# EAGLE schematic MoreE u-blox E-PEAS (EAGLE 9.4.2)

## Sheet 1 of 2
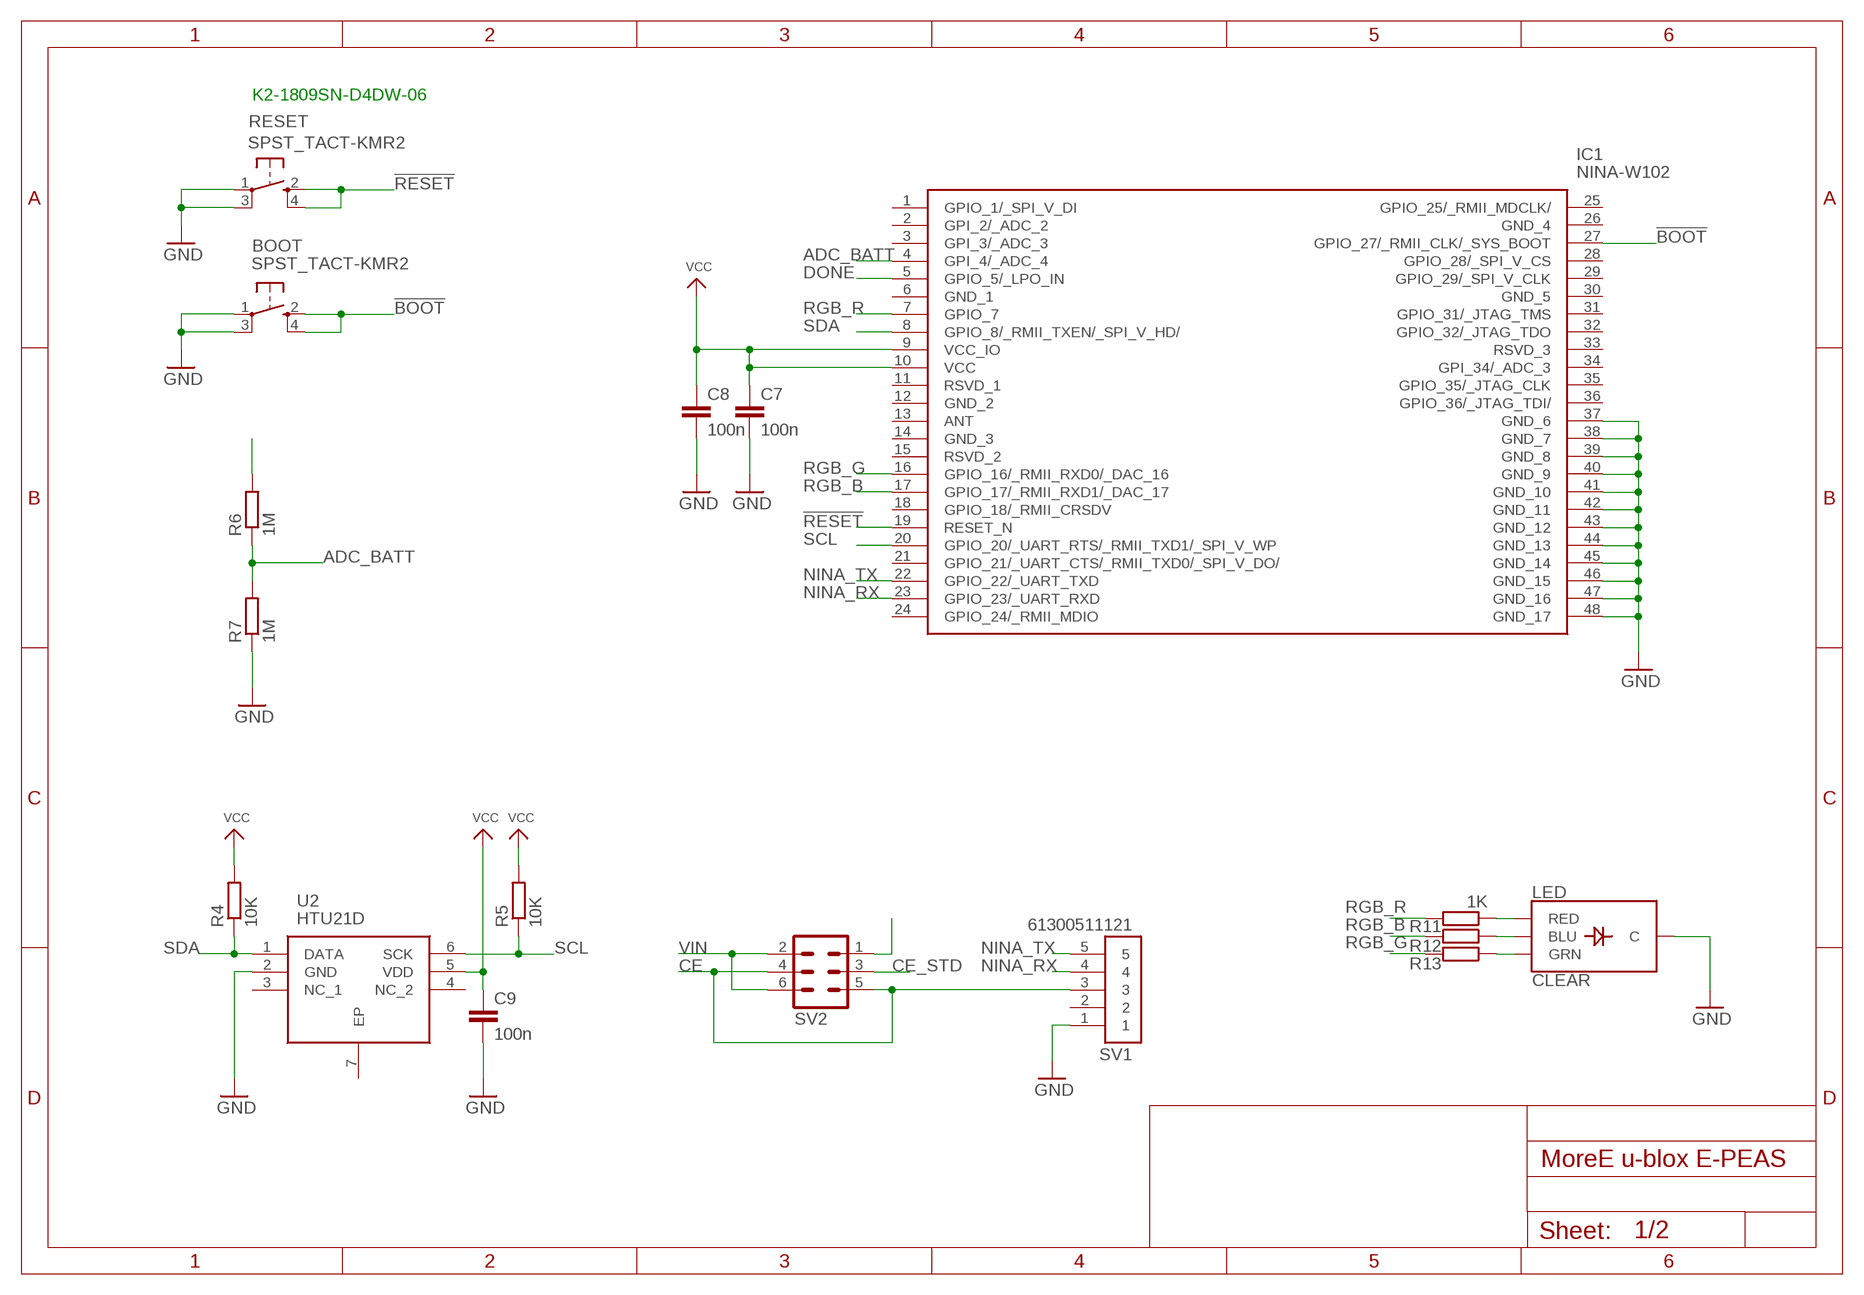
[diagram p0: schematic, sheet 1]

### Parts
BOOT  SPST_TACT-KMR2  [KMR2]
C7  100n  C-EUC0805  [C0805]
C8  100n  C-EUC0805  [C0805]
C9  100n  C-EUC0805  [C0805]
IC1  NINA-W102  [NINAW102]
LED  CLEAR  LED-RGB-CCCLEAR  [LED-RGB-THRU]
R4  10K  R-EU_R0805  [R0805]
R5  10K  R-EU_R0805  [R0805]
R6  1M  R-EU_R0805  [R0805]
R7  1M  R-EU_R0805  [R0805]
R11  1K  R-EU_R0805  [R0805]
R12  1K  R-EU_R0805  [R0805]
R13  1K  R-EU_R0805  [R0805]
RESET  SPST_TACT-KMR2  [KMR2]
SV1  61300511121  [61300511121]
SV2  MA03-2  [MA03-2]
U2  HTU21D  [SON100P300X300X100-7N]

### Nets
!BOOT: BOOT.2(S) BOOT.4(S1) IC1.27(GPIO_27/_RMII_CLK/_SYS_BOOT)
!RESET: IC1.19(RESET_N) RESET.2(S) RESET.4(S1)
ADC_BATT: IC1.4(GPI_4/_ADC_4) R6.1 R7.2
CE: SV1.3 SV2.4 SV2.5 ; also sheet 2
CE_STD: SV2.3 ; also sheet 2
DONE: IC1.5(GPIO_5/_LPO_IN) ; also sheet 2
GND: BOOT.1(P) BOOT.3(P1) C7.2 C8.2 C9.2 IC1.37(GND_6) IC1.38(GND_7) IC1.39(GND_8) IC1.40(GND_9) IC1.41(GND_10) IC1.42(GND_11) IC1.43(GND_12) IC1.44(GND_13) IC1.45(GND_14) IC1.46(GND_15) IC1.47(GND_16) IC1.48(GND_17) LED.2(C) R7.1 RESET.1(P) RESET.3(P1) SV1.1 U2.2(GND) ; also sheet 2
N$9: SV2.1
N$10: R6.2
N$13: LED.1(RED) R11.1
N$14: LED.4(BLU) R12.1
N$15: LED.3(GRN) R13.1
NINA_RX: IC1.23(GPIO_23/_UART_RXD) SV1.4
NINA_TX: IC1.22(GPIO_22/_UART_TXD) SV1.5
RGB_B: IC1.17(GPIO_17/_RMII_RXD1/_DAC_17) R12.2
RGB_G: IC1.16(GPIO_16/_RMII_RXD0/_DAC_16) R13.2
RGB_R: IC1.7(GPIO_7) R11.2
SCL: IC1.20(GPIO_20/_UART_RTS/_RMII_TXD1/_SPI_V_WP) R5.1 U2.6(SCK)
SDA: IC1.8(GPIO_8/_RMII_TXEN/_SPI_V_HD/) R4.1 U2.1(DATA)
VCC: C7.1 C8.1 C9.1 IC1.9(VCC_IO) IC1.10(VCC) R4.2 R5.2 U2.5(VDD) ; also sheet 2
VIN: SV2.2 SV2.6 ; also sheet 2
Unconnected: IC1.1(GPIO_1/_SPI_V_DI) IC1.2(GPI_2/_ADC_2) IC1.3(GPI_3/_ADC_3) IC1.6(GND_1) IC1.11(RSVD_1) IC1.12(GND_2) IC1.13(ANT) IC1.14(GND_3) IC1.15(RSVD_2) IC1.18(GPIO_18/_RMII_CRSDV) IC1.21(GPIO_21/_UART_CTS/_RMII_TXD0/_SPI_V_DO/) IC1.24(GPIO_24/_RMII_MDIO) IC1.25(GPIO_25/_RMII_MDCLK/) IC1.26(GND_4) IC1.28(GPIO_28/_SPI_V_CS) IC1.29(GPIO_29/_SPI_V_CLK) IC1.30(GND_5) IC1.31(GPIO_31/_JTAG_TMS) IC1.32(GPIO_32/_JTAG_TDO) IC1.33(RSVD_3) IC1.34(GPI_34/_ADC_3) IC1.35(GPIO_35/_JTAG_CLK) IC1.36(GPIO_36/_JTAG_TDI/) SV1.2 U2.3(NC_1) U2.4(NC_2) U2.7(EP)

### Notes on the sheet
- K2-1809SN-D4DW-06

## Sheet 2 of 2
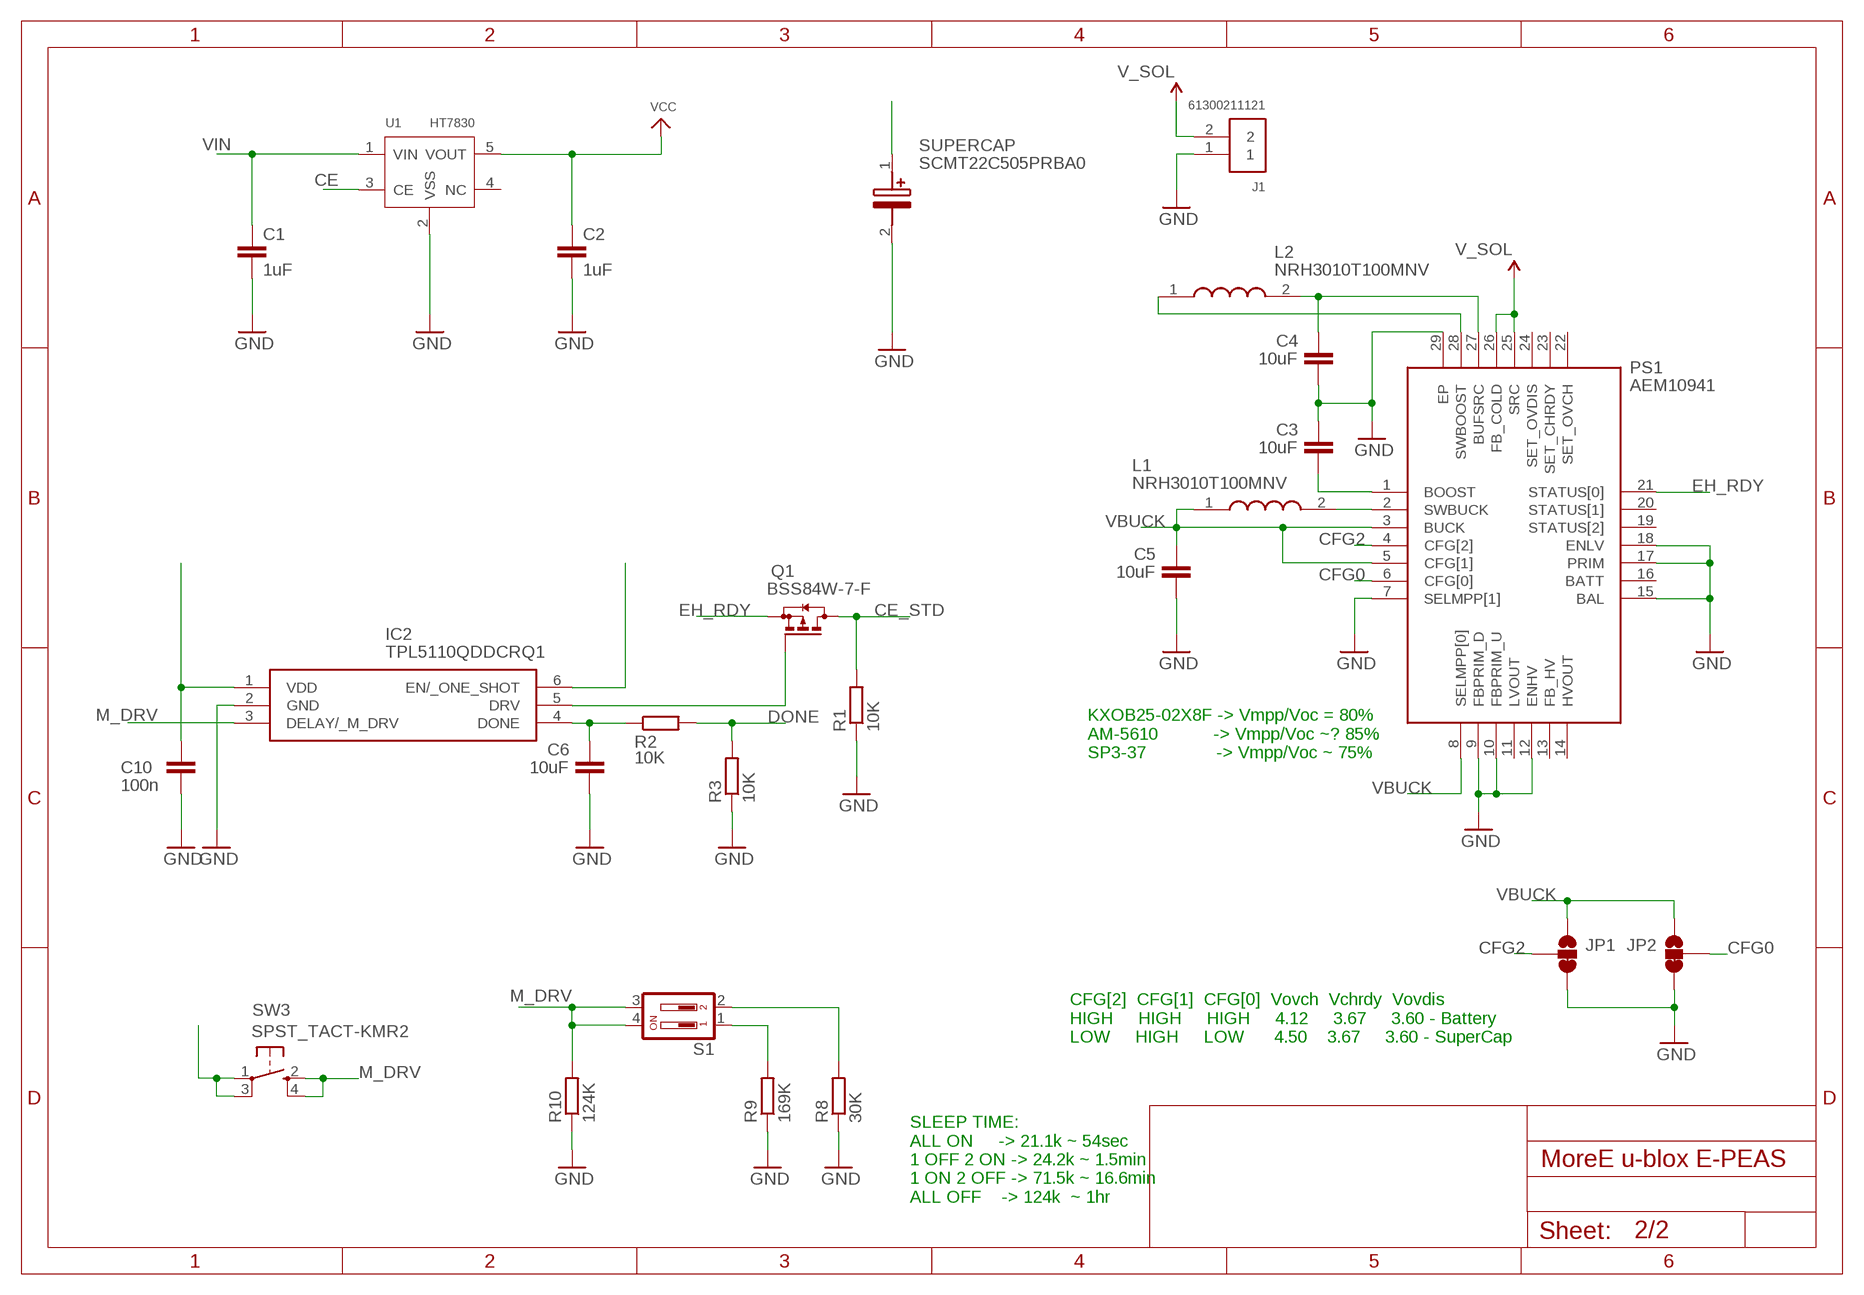
[diagram p1: schematic, sheet 2]

### Parts
C1  1uF  C-EUC0805  [C0805]
C2  1uF  C-EUC0805  [C0805]
C3  10uF  C-EUC0805  [C0805]
C4  10uF  C-EUC0805  [C0805]
C5  10uF  C-EUC0805  [C0805]
C6  10uF  C-EUC0805  [C0805]
C10  100n  C-EUC0805  [C0805]
IC2  TPL5110QDDCRQ1  [SOT95P280X110-6N]
J1  61300211121  [61300211121]
JP1  JUMPER-SMT_3_1-NC_TRACE_SILK  [SMT-JUMPER_3_1-NC_TRACE_SILK]
JP2  JUMPER-SMT_3_1-NC_TRACE_SILK  [SMT-JUMPER_3_1-NC_TRACE_SILK]
L1  NRH3010T100MNV  [NRH3010T100MNV]
L2  NRH3010T100MNV  [NRH3010T100MNV]
PS1  AEM10941  [QFN50P500X500X90-29N]
Q1  BSS84W-7-F  BSS84  [SOT23]
R1  10K  R-EU_R0805  [R0805]
R2  10K  R-EU_R0805  [R0805]
R3  10K  R-EU_R0805  [R0805]
R8  30K  R-EU_R0805  [R0805]
R9  169K  R-EU_R0805  [R0805]
R10  124K  R-EU_R0805  [R0805]
S1  DP02  [DP-02]
SUPERCAP  SCMT22C505PRBA0  [SCMT22C505PRBA0]
SW3  SPST_TACT-KMR2  [KMR2]
U1  HT7830  PMIC-LDO-XC6204B332MR(SOT23-5)  [SOT-23-5]

### Nets
CE: U1.3(CE) ; also sheet 1
CE_STD: Q1.3(D) R1.2 ; also sheet 1
CFG0: JP2.2 PS1.6(CFG[0])
CFG2: JP1.2 PS1.4(CFG[2])
DONE: R2.2 R3.2 ; also sheet 1
EH_RDY: PS1.21(STATUS[0]) Q1.2(S)
GND: C1.2 C2.2 C3.1 C4.2 C5.2 C6.2 C10.2 IC2.2(GND) J1.1 JP1.3 JP2.3 PS1.7(SELMPP[1]) PS1.9(FBPRIM_D) PS1.10(FBPRIM_U) PS1.12(ENHV) PS1.15(BAL) PS1.17(PRIM) PS1.18(ENLV) PS1.29(EP) R1.1 R3.1 R8.1 R9.1 R10.1 SUPERCAP.2(+) U1.2(VSS) ; also sheet 1
M_DRV: IC2.3(DELAY/_M_DRV) R10.2 S1.3 S1.4 SW3.2(S) SW3.4(S1)
N$1: C6.1 IC2.4(DONE) R2.1
N$2: L1.2 PS1.2(SWBUCK)
N$3: IC2.5(DRV) Q1.1(G)
N$4: C4.1 L2.2 PS1.27(BUFSRC)
N$5: L2.1 PS1.28(SWBOOST)
N$6: C3.2 PS1.1(BOOST)
N$7: R9.2 S1.1
N$8: R8.2 S1.2
N$11: SUPERCAP.1(-)
N$12: SW3.1(P) SW3.3(P1)
V_SOL: PS1.25(SRC) PS1.26(FB_COLD)
VBATT: C10.1 IC2.1(VDD) IC2.6(EN/_ONE_SHOT)
VBUCK: C5.1 JP1.1 JP2.1 L1.1 PS1.3(BUCK) PS1.5(CFG[1]) PS1.8(SELMPP[0])
VCC: C2.1 J1.2 U1.5(VOUT) ; supply symbol labelled V_SOL ; also sheet 1
VIN: C1.1 U1.1(VIN) ; also sheet 1
Unconnected: PS1.11(LVOUT) PS1.13(FB_HV) PS1.14(HVOUT) PS1.16(BATT) PS1.19(STATUS[2]) PS1.20(STATUS[1]) PS1.22(SET_OVCH) PS1.23(SET_CHRDY) PS1.24(SET_OVDIS) U1.4(NC)

### Notes on the sheet
- KXOB25-02X8F -> Vmpp/Voc = 80%
  AM-5610           -> Vmpp/Voc ~? 85%
  SP3-37              -> Vmpp/Voc ~ 75%
- CFG[2]  CFG[1]  CFG[0]  Vovch  Vchrdy  Vovdis
  HIGH     HIGH     HIGH     4.12     3.67     3.60 - Battery
  LOW     HIGH     LOW      4.50    3.67     3.60 - SuperCap
- SLEEP TIME:
  ALL ON     -> 21.1k ~ 54sec
  1 OFF 2 ON -> 24.2k ~ 1.5min
  1 ON 2 OFF -> 71.5k ~ 16.6min
  ALL OFF    -> 124k  ~ 1hr

## Library data of the parts
BOOT RESET SW3 = adafruit:SPST_TACT: SMT 6mm switch, EVQQ2 series http://www.ladyada.net/library/eagle
C1-C10 = resistor:C-EU: CAPACITOR, European symbol
IC1 = SamacSys_Parts:NINA-W102: STAND-ALONE MULTIRADIO MODULE Source: Datasheet <https://www.u-blox.com/sites/default/files/NINA-W10_DataSheet_(UBX-17065507).pdf>; DESCRIPTION: STAND-ALONE MULTIRADIO MODULE; HEIGHT: 3mm; MANUFACTURER_NAME: U-Blox; MANUFACTURER_PART_NUMBER: NINA-W102
IC2 = SamacSys_Parts:TPL5110QDDCRQ1: Ultra Low Power System Timer (35 nA) for Power Gating in Automotive Duty-cycled Applications Source: Datasheet <http://www.ti.com/lit/gpn/tpl5110-q1>; DESCRIPTION: Ultra Low Power System Timer (35 nA) for Power Gating in Automotive Duty-cycled Applications; HEIGHT: 1.1mm; MANUFACTURER_NAME: Texas Instruments; MANUFACTURER_PART_NUMBER: TPL5110QDDCRQ1; MOUSER_PART_NUMBER: 595-TPL5110QDDCRQ1; MOUSER_PRICE-STOCK: https://www.mouser.com/Search/Refine.aspx?Keyword=595-TPL5110QDDCRQ1
J1 = Headers:61300211121: CONN HEADER VERT 2POS 2.54MM Manufacturer's datasheet <https://katalog.we-online.de/em/datasheet/6130xx11121.pdf>; CREATED_BY: PCBLayout.com; DIGI_KEY_PART_NUMBER: 732-5315-ND; MANUFACTURER: Wurth Electronics Inc.; MPN: 61300211121
JP1 JP2 = SparkFun-Jumpers:JUMPER-SMT_3_1-NC_TRACE: Normally closed trace jumper (1 of 2 connections) This jumper has a trace between two pads so it's normally closed (NC). The other connection is normally open (NO). Use a razor knife to open the connection. For best results follow the IPC guidelines for cutting traces: Cutout at least 0.063 mm (0.005 in). Remove all loose material to clean up the cut area. Seal the cut with an approved epoxy. Reapply solder to reclose the connection, or to close the NO connection.
L1 L2 = SamacSys_Parts:NRH3010T100MNV: Fixed Inductors 3010 10uH 420mOhms +/-20%Tol 600mA Q200 Source: Datasheet <https://componentsearchengine.com/Datasheets/1/NRH3010T100MNV.pdf>; DESCRIPTION: Fixed Inductors 3010 10uH 420mOhms +/-20%Tol 600mA Q200; HEIGHT: mm; MANUFACTURER_NAME: TAIYO YUDEN; MANUFACTURER_PART_NUMBER: NRH3010T100MNV; MOUSER_PART_NUMBER: 963-NRH3010T100MNV; MOUSER_PRICE-STOCK: https://www.mouser.com/Search/Refine.aspx?Keyword=963-NRH3010T100MNV
LED = SparkFun-LED:LED-RGB-CC: LED-RGB Common Cathode Packages: LED RGB-THRU LED_PIRANHA_5MM SparkFun Products: RGB Diffused Common Cathode- Diffuse <[https://www.sparkfun.com/products/9264]> RGB Diffused Common Cathode - Clear <[https://www.sparkfun.com/products/105]> LED-RGB 5mm Square (Piranha) <[https://www.sparkfun.com/products/11679]>; PROD_ID: DIO-08418
PS1 = SamacSys_Parts:AEM10941: AEM10941 Highly Efficient, Dual Regulated Output, Ambient Energy Manager for up to 7 cells solar panels with optional primary battery Source: Datasheet <http://e-peas.com/wp-content/uploads/2017/07/PB_AEM10941_REV0-1b.pdf>; DESCRIPTION: AEM10941 Highly Efficient, Dual Regulated Output, Ambient Energy Manager for up to 7 cells solar panels with optional primary battery; HEIGHT: 0.9mm; MANUFACTURER_NAME: ebm-papst; MANUFACTURER_PART_NUMBER: AEM10941
Q1 = transistor-small-signal:BSS84: P-CHANNEL MOS FET
R1-R7 R11-R13 = resistor:R-EU_: RESISTOR, European symbol
R8-R10 = resistor:R-EU_: RESISTOR, European symbol; PNUM: 0805W8F1243T5E
S1 = switch-dil:DP02: DIL/CODE SWITCH; MPN: MCDP02; OC_FARNELL: 1255233; OC_NEWARK: 26M1095
SUPERCAP = SamacSys_Parts:SCMT22C505PRBA0: Supercapacitors / Ultracapacitors 5V 5F ER65mOhm Source: Datasheet <https://componentsearchengine.com/Datasheets/1/SCMT22C505PRBA0.pdf>; DESCRIPTION: Supercapacitors / Ultracapacitors 5V 5F ER65mOhm; HEIGHT: 23.5mm; MANUFACTURER_NAME: AVX; MANUFACTURER_PART_NUMBER: SCMT22C505PRBA0; MOUSER_PART_NUMBER: 581-SCMT22C505PRBA0; MOUSER_PRICE-STOCK: https://www.mouser.com/Search/Refine.aspx?Keyword=581-SCMT22C505PRBA0
SV1 = Headers:61300511121: CONN HEADER VERT 5POS 2.54MM Manufacturer's datasheet <https://katalog.we-online.de/em/datasheet/6130xx11121.pdf>; CREATED_BY: PCBLayout.com; DIGI_KEY_PART_NUMBER: 732-5318-ND; MANUFACTURER: Wurth Electronics Inc.; MPN: 61300511121
SV2 = con-lstb:MA03-2: PIN HEADER; OC_FARNELL: unknown; OC_NEWARK: unknown
U1 = OPL_IC:PMIC-LDO-XC6204B332MR(SOT23-5): 310030046; MPN: XC6204B332MR; VALUE: XC6204B332MR-SOT23-5
U2 = SamacSys_Parts:HTU21D: SENSOR SOLUTIONS - TE CONNECTIVITY - HTU21D - HUMIDITY/TEMP SENSOR, DIGITAL, DFN-6 Source: Datasheet <https://componentsearchengine.com/Datasheets/1/HTU21D.pdf>; DESCRIPTION: SENSOR SOLUTIONS - TE CONNECTIVITY - HTU21D - HUMIDITY/TEMP SENSOR, DIGITAL, DFN-6; HEIGHT: 1mm; MANUFACTURER_NAME: TE Connectivity; MANUFACTURER_PART_NUMBER: HTU21D; MOUSER_PART_NUMBER: 824-HTU21D; MOUSER_PRICE-STOCK: https://www.mouser.com/Search/Refine.aspx?Keyword=824-HTU21D

## Net classes
0 default: clearance 0.089 mm